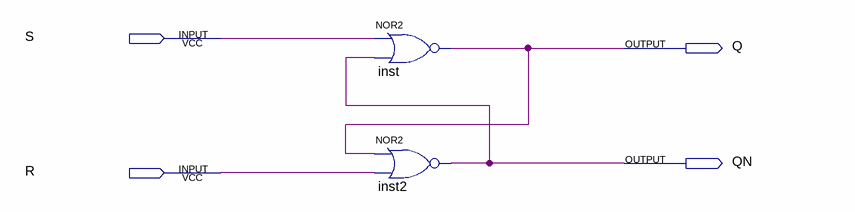
[diagram p0: schematic sheet]
// Quartus schematic sr_ff_or.bdf as structural Verilog: 2 symbols, 4 pins
module sr_ff_or (
  input  S,
  input  R,
  output Q,
  output QN
);

  nor inst (Q, S, QN);
  nor inst2 (QN, Q, R);
endmodule
